# Altium schematic sheet [07] - QSFP28_1.SchDoc: QSFP28 Module
size A3; Engineer: *ORCEL THYS; DocumentNumber: 3; SheetNumber: 3; SheetTotal: 14
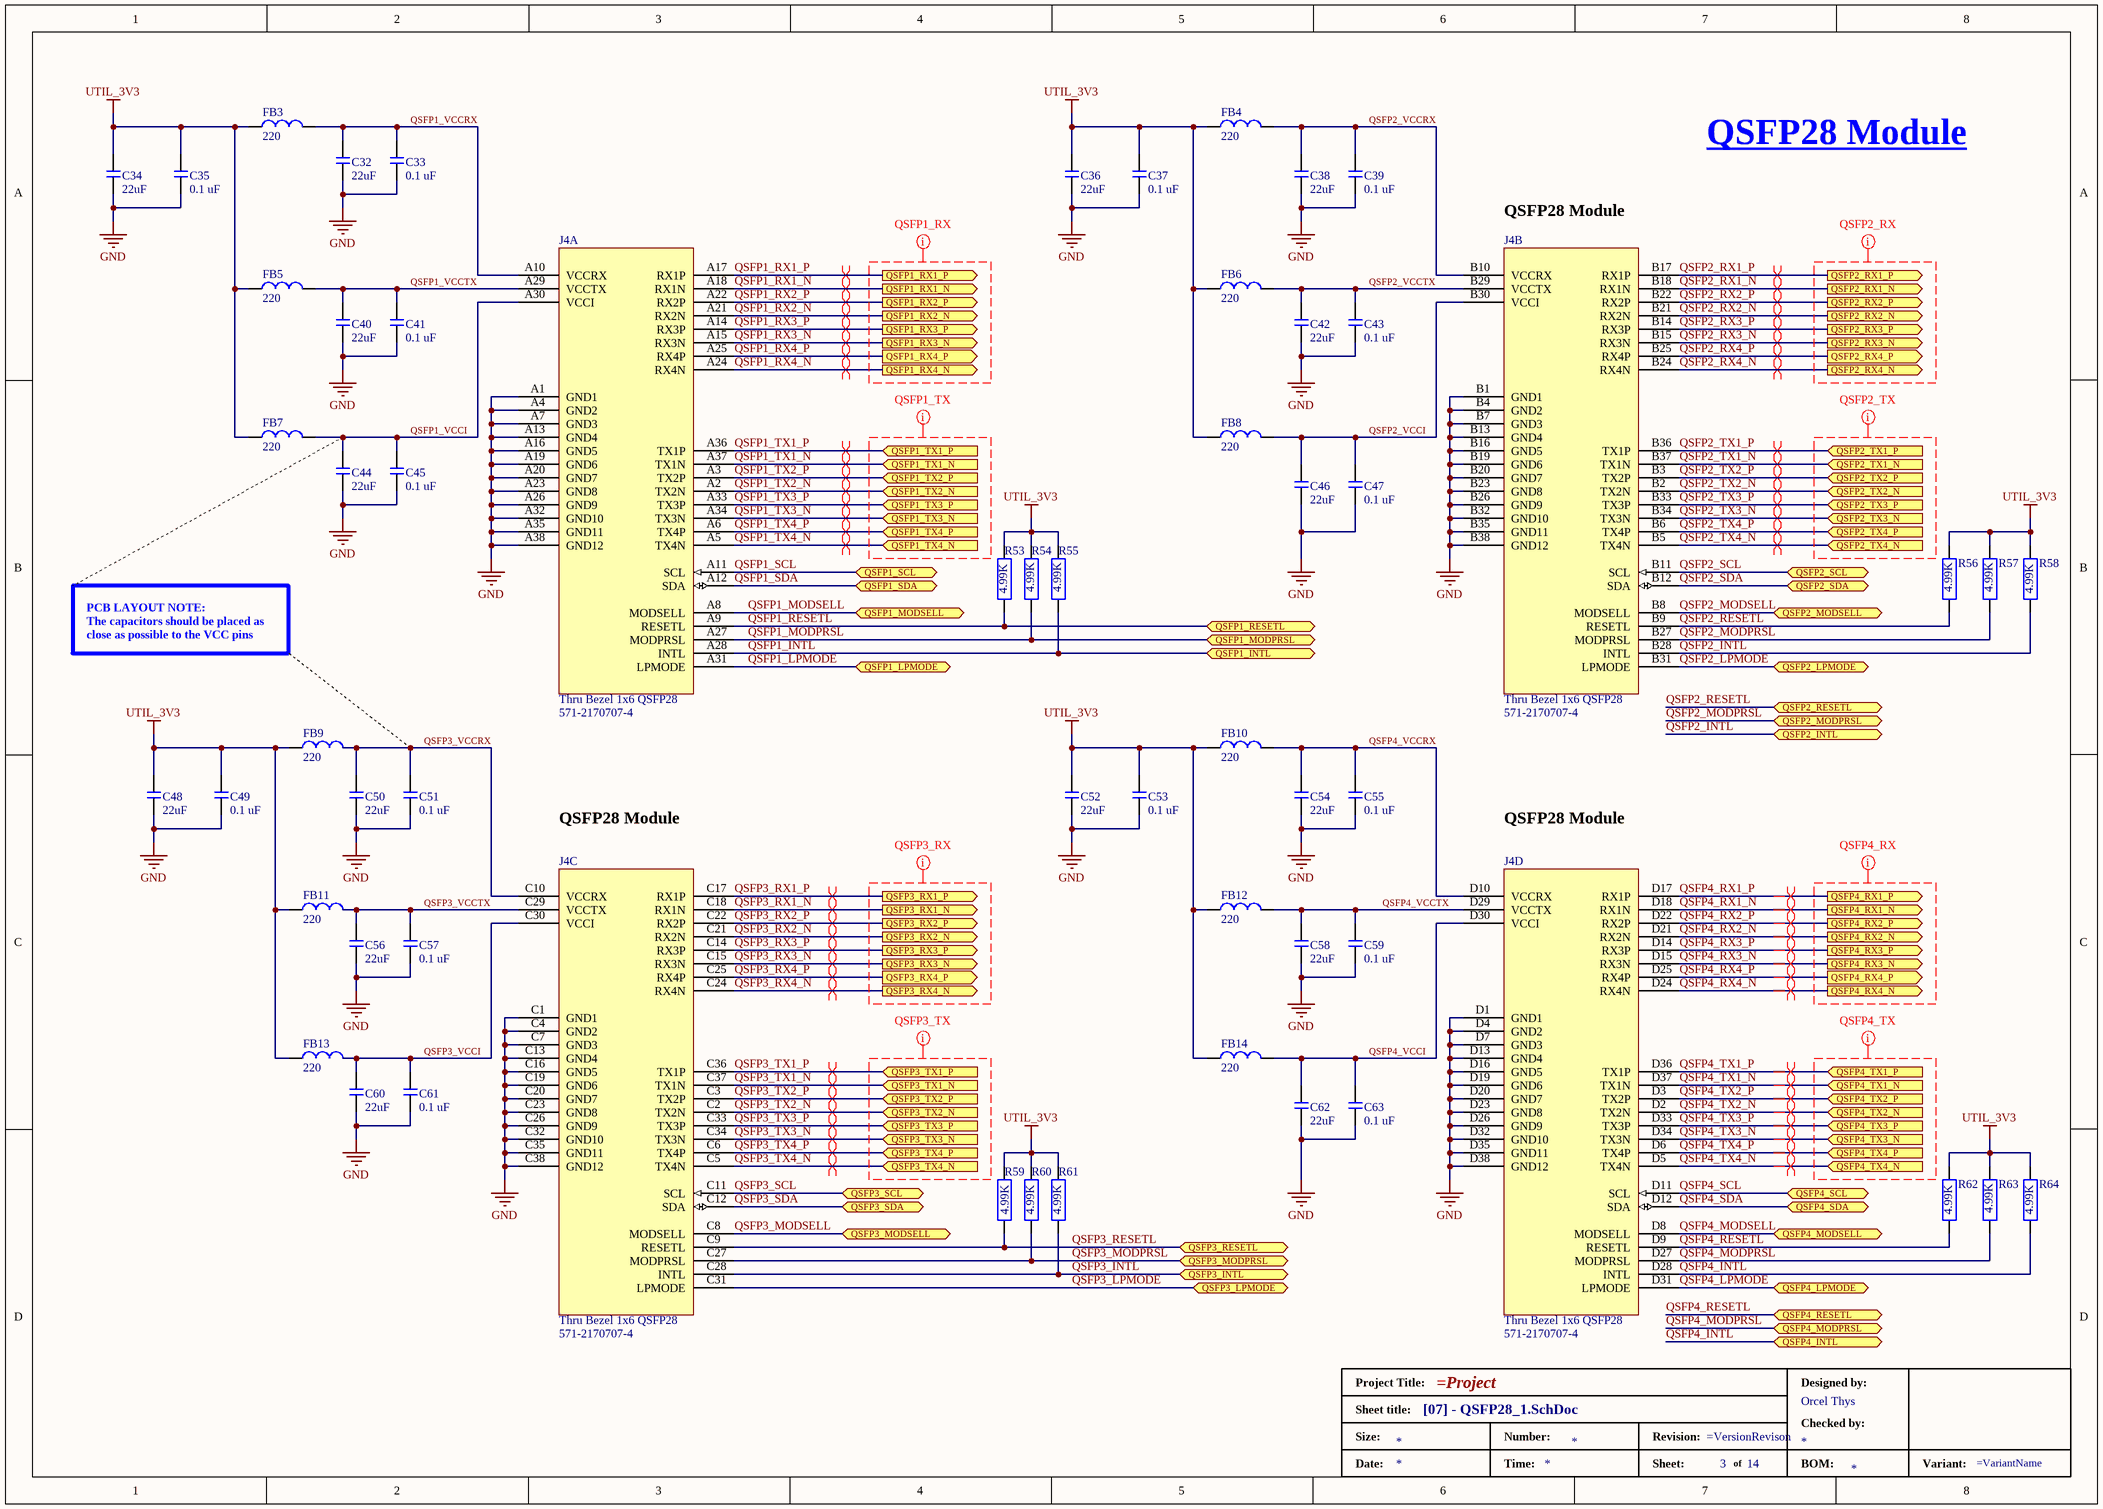
[diagram p0: [07] - QSFP28_1.SchDoc]

## Parts
*  DesignedBy: Orcel Thys  (hidden comment: Standard Title Block)  (graphical)
C32  22uF  [C2012]
C33  0.1 uF  [C0402]
C34  22uF  [C2012]
C35  0.1 uF  [C0402]
C36  22uF  [C2012]
C37  0.1 uF  [C0402]
C38  22uF  [C2012]
C39  0.1 uF  [C0402]
C40  22uF  [C2012]
C41  0.1 uF  [C0402]
C42  22uF  [C2012]
C43  0.1 uF  [C0402]
C44  22uF  [C2012]
C45  0.1 uF  [C0402]
C46  22uF  [C2012]
C47  0.1 uF  [C0402]
C48  22uF  [C2012]
C49  0.1 uF  [C0402]
C50  22uF  [C2012]
C51  0.1 uF  [C0402]
C52  22uF  [C2012]
C53  0.1 uF  [C0402]
C54  22uF  [C2012]
C55  0.1 uF  [C0402]
C56  22uF  [C2012]
C57  0.1 uF  [C0402]
C58  22uF  [C2012]
C59  0.1 uF  [C0402]
C60  22uF  [C2012]
C61  0.1 uF  [C0402]
C62  22uF  [C2012]
C63  0.1 uF  [C0402]
FB3  220  [BEADC1608X75N]
FB4  220  [BEADC1608X75N]
FB5  220  [BEADC1608X75N]
FB6  220  [BEADC1608X75N]
FB7  220  [BEADC1608X75N]
FB8  220  [BEADC1608X75N]
FB9  220  [BEADC1608X75N]
FB10  220  [BEADC1608X75N]
FB11  220  [BEADC1608X75N]
FB12  220  [BEADC1608X75N]
FB13  220  [BEADC1608X75N]
FB14  220  [BEADC1608X75N]
J4  Thru Bezel 1x6 QSFP28  Supplier Part Number 1: 571-2170707-4  [TE_2170707-4]  (parts A,B,C,D of 7)
R53  4.99K  [R0402]
R54  4.99K  [R0402]
R55  4.99K  [R0402]
R56  4.99K  [R0402]
R57  4.99K  [R0402]
R58  4.99K  [R0402]
R59  4.99K  [R0402]
R60  4.99K  [R0402]
R61  4.99K  [R0402]
R62  4.99K  [R0402]
R63  4.99K  [R0402]
R64  4.99K  [R0402]

## Ports
QSFP1_INTL (bidir), QSFP1_LPMODE (bidir), QSFP1_MODPRSL (bidir), QSFP1_MODSELL (bidir), QSFP1_RESETL (bidir), QSFP1_RX1_N (out), QSFP1_RX1_P (out), QSFP1_RX2_N (out), QSFP1_RX2_P (out), QSFP1_RX3_N (out), QSFP1_RX3_P (out), QSFP1_RX4_N (out), QSFP1_RX4_P (out), QSFP1_SCL (bidir), QSFP1_SDA (bidir), QSFP1_TX1_N (in), QSFP1_TX1_P (in), QSFP1_TX2_N (in), QSFP1_TX2_P (in), QSFP1_TX3_N (in), QSFP1_TX3_P (in), QSFP1_TX4_N (in), QSFP1_TX4_P (in), QSFP2_INTL (bidir), QSFP2_LPMODE (bidir), QSFP2_MODPRSL (bidir), QSFP2_MODSELL (bidir), QSFP2_RESETL (bidir), QSFP2_RX1_N (out), QSFP2_RX1_P (out), QSFP2_RX2_N (out), QSFP2_RX2_P (out), QSFP2_RX3_N (out), QSFP2_RX3_P (out), QSFP2_RX4_N (out), QSFP2_RX4_P (out), QSFP2_SCL (bidir), QSFP2_SDA (bidir), QSFP2_TX1_N (in), QSFP2_TX1_P (in), QSFP2_TX2_N (in), QSFP2_TX2_P (in), QSFP2_TX3_N (in), QSFP2_TX3_P (in), QSFP2_TX4_N (in), QSFP2_TX4_P (in), QSFP3_INTL (bidir), QSFP3_LPMODE (bidir), QSFP3_MODPRSL (bidir), QSFP3_MODSELL (bidir), QSFP3_RESETL (bidir), QSFP3_RX1_N (out), QSFP3_RX1_P (out), QSFP3_RX2_N (out), QSFP3_RX2_P (out), QSFP3_RX3_N (out), QSFP3_RX3_P (out), QSFP3_RX4_N (out), QSFP3_RX4_P (out), QSFP3_SCL (bidir), QSFP3_SDA (bidir), QSFP3_TX1_N (in), QSFP3_TX1_P (in), QSFP3_TX2_N (in), QSFP3_TX2_P (in), QSFP3_TX3_N (in), QSFP3_TX3_P (in), QSFP3_TX4_N (in), QSFP3_TX4_P (in), QSFP4_INTL (bidir), QSFP4_LPMODE (bidir), QSFP4_MODPRSL (bidir), QSFP4_MODSELL (bidir), QSFP4_RESETL (bidir), QSFP4_RX1_N (out), QSFP4_RX1_P (out), QSFP4_RX2_N (out), QSFP4_RX2_P (out), QSFP4_RX3_N (out), QSFP4_RX3_P (out), QSFP4_RX4_N (out), QSFP4_RX4_P (out), QSFP4_SCL (bidir), QSFP4_SDA (bidir), QSFP4_TX1_N (in), QSFP4_TX1_P (in), QSFP4_TX2_N (in), QSFP4_TX2_P (in), QSFP4_TX3_N (in), QSFP4_TX3_P (in), QSFP4_TX4_N (in), QSFP4_TX4_P (in)

## Nets
GND: C32.1 C33.1 C34.1 C35.1 C36.1 C37.1 C38.1 C39.1 C40.1 C41.1 C42.1 C43.1 C44.1 C45.1 C46.1 C47.1 C48.1 C49.1 C50.1 C51.1 C52.1 C53.1 C54.1 C55.1 C56.1 C57.1 C58.1 C59.1 C60.1 C61.1 C62.1 C63.1 J4.A1(GND1) J4.A4(GND2) J4.A7(GND3) J4.A13(GND4) J4.A16(GND5) J4.A19(GND6) J4.A20(GND7) J4.A23(GND8) J4.A26(GND9) J4.A32(GND10) J4.A35(GND11) J4.A38(GND12) J4.B1(GND1) J4.B4(GND2) J4.B7(GND3) J4.B13(GND4) J4.B16(GND5) J4.B19(GND6) J4.B20(GND7) J4.B23(GND8) J4.B26(GND9) J4.B32(GND10) J4.B35(GND11) J4.B38(GND12) J4.C1(GND1) J4.C4(GND2) J4.C7(GND3) J4.C13(GND4) J4.C16(GND5) J4.C19(GND6) J4.C20(GND7) J4.C23(GND8) J4.C26(GND9) J4.C32(GND10) J4.C35(GND11) J4.C38(GND12) J4.D1(GND1) J4.D4(GND2) J4.D7(GND3) J4.D13(GND4) J4.D16(GND5) J4.D19(GND6) J4.D20(GND7) J4.D23(GND8) J4.D26(GND9) J4.D32(GND10) J4.D35(GND11) J4.D38(GND12)
UTIL_3V3: C34.2 C35.2 C36.2 C37.2 C48.2 C49.2 C52.2 C53.2 FB3.1 FB4.1 FB5.1 FB6.1 FB7.1 FB8.1 FB9.1 FB10.1 FB11.1 FB12.1 FB13.1 FB14.1 R53.2 R54.2 R55.2 R56.2 R57.2 R58.2 R59.2 R60.2 R61.2 R62.2 R63.2 R64.2
QSFP1_INTL: J4.A28(INTL) R55.1 ; port QSFP1_INTL
QSFP1_LPMODE: J4.A31(LPMODE) ; port QSFP1_LPMODE
QSFP1_MODPRSL: J4.A27(MODPRSL) R54.1 ; port QSFP1_MODPRSL
QSFP1_MODSELL: J4.A8(MODSELL) ; port QSFP1_MODSELL
QSFP1_RESETL: J4.A9(RESETL) R53.1 ; port QSFP1_RESETL
QSFP1_RX1_N: J4.A18(RX1N) ; port QSFP1_RX1_N
QSFP1_RX1_P: J4.A17(RX1P) ; port QSFP1_RX1_P
QSFP1_RX2_N: J4.A21(RX2N) ; port QSFP1_RX2_N
QSFP1_RX2_P: J4.A22(RX2P) ; port QSFP1_RX2_P
QSFP1_RX3_N: J4.A15(RX3N) ; port QSFP1_RX3_N
QSFP1_RX3_P: J4.A14(RX3P) ; port QSFP1_RX3_P
QSFP1_RX4_N: J4.A24(RX4N) ; port QSFP1_RX4_N
QSFP1_RX4_P: J4.A25(RX4P) ; port QSFP1_RX4_P
QSFP1_SCL: J4.A11(SCL) ; port QSFP1_SCL
QSFP1_SDA: J4.A12(SDA) ; port QSFP1_SDA
QSFP1_TX1_N: J4.A37(TX1N) ; port QSFP1_TX1_N
QSFP1_TX1_P: J4.A36(TX1P) ; port QSFP1_TX1_P
QSFP1_TX2_N: J4.A2(TX2N) ; port QSFP1_TX2_N
QSFP1_TX2_P: J4.A3(TX2P) ; port QSFP1_TX2_P
QSFP1_TX3_N: J4.A34(TX3N) ; port QSFP1_TX3_N
QSFP1_TX3_P: J4.A33(TX3P) ; port QSFP1_TX3_P
QSFP1_TX4_N: J4.A5(TX4N) ; port QSFP1_TX4_N
QSFP1_TX4_P: J4.A6(TX4P) ; port QSFP1_TX4_P
QSFP1_VCCI: C44.2 C45.2 FB7.2 J4.A30(VCCI)
QSFP1_VCCRX: C32.2 C33.2 FB3.2 J4.A10(VCCRX)
QSFP1_VCCTX: C40.2 C41.2 FB5.2 J4.A29(VCCTX)
QSFP2_INTL: J4.B28(INTL) R58.1 ; port QSFP2_INTL
QSFP2_LPMODE: J4.B31(LPMODE) ; port QSFP2_LPMODE
QSFP2_MODPRSL: J4.B27(MODPRSL) R57.1 ; port QSFP2_MODPRSL
QSFP2_MODSELL: J4.B8(MODSELL) ; port QSFP2_MODSELL
QSFP2_RESETL: J4.B9(RESETL) R56.1 ; port QSFP2_RESETL
QSFP2_RX1_N: J4.B18(RX1N) ; port QSFP2_RX1_N
QSFP2_RX1_P: J4.B17(RX1P) ; port QSFP2_RX1_P
QSFP2_RX2_N: J4.B21(RX2N) ; port QSFP2_RX2_N
QSFP2_RX2_P: J4.B22(RX2P) ; port QSFP2_RX2_P
QSFP2_RX3_N: J4.B15(RX3N) ; port QSFP2_RX3_N
QSFP2_RX3_P: J4.B14(RX3P) ; port QSFP2_RX3_P
QSFP2_RX4_N: J4.B24(RX4N) ; port QSFP2_RX4_N
QSFP2_RX4_P: J4.B25(RX4P) ; port QSFP2_RX4_P
QSFP2_SCL: J4.B11(SCL) ; port QSFP2_SCL
QSFP2_SDA: J4.B12(SDA) ; port QSFP2_SDA
QSFP2_TX1_N: J4.B37(TX1N) ; port QSFP2_TX1_N
QSFP2_TX1_P: J4.B36(TX1P) ; port QSFP2_TX1_P
QSFP2_TX2_N: J4.B2(TX2N) ; port QSFP2_TX2_N
QSFP2_TX2_P: J4.B3(TX2P) ; port QSFP2_TX2_P
QSFP2_TX3_N: J4.B34(TX3N) ; port QSFP2_TX3_N
QSFP2_TX3_P: J4.B33(TX3P) ; port QSFP2_TX3_P
QSFP2_TX4_N: J4.B5(TX4N) ; port QSFP2_TX4_N
QSFP2_TX4_P: J4.B6(TX4P) ; port QSFP2_TX4_P
QSFP2_VCCI: C46.2 C47.2 FB8.2 J4.B30(VCCI)
QSFP2_VCCRX: C38.2 C39.2 FB4.2 J4.B10(VCCRX)
QSFP2_VCCTX: C42.2 C43.2 FB6.2 J4.B29(VCCTX)
QSFP3_INTL: J4.C28(INTL) R61.1 ; port QSFP3_INTL
QSFP3_LPMODE: J4.C31(LPMODE) ; port QSFP3_LPMODE
QSFP3_MODPRSL: J4.C27(MODPRSL) R60.1 ; port QSFP3_MODPRSL
QSFP3_MODSELL: J4.C8(MODSELL) ; port QSFP3_MODSELL
QSFP3_RESETL: J4.C9(RESETL) R59.1 ; port QSFP3_RESETL
QSFP3_RX1_N: J4.C18(RX1N) ; port QSFP3_RX1_N
QSFP3_RX1_P: J4.C17(RX1P) ; port QSFP3_RX1_P
QSFP3_RX2_N: J4.C21(RX2N) ; port QSFP3_RX2_N
QSFP3_RX2_P: J4.C22(RX2P) ; port QSFP3_RX2_P
QSFP3_RX3_N: J4.C15(RX3N) ; port QSFP3_RX3_N
QSFP3_RX3_P: J4.C14(RX3P) ; port QSFP3_RX3_P
QSFP3_RX4_N: J4.C24(RX4N) ; port QSFP3_RX4_N
QSFP3_RX4_P: J4.C25(RX4P) ; port QSFP3_RX4_P
QSFP3_SCL: J4.C11(SCL) ; port QSFP3_SCL
QSFP3_SDA: J4.C12(SDA) ; port QSFP3_SDA
QSFP3_TX1_N: J4.C37(TX1N) ; port QSFP3_TX1_N
QSFP3_TX1_P: J4.C36(TX1P) ; port QSFP3_TX1_P
QSFP3_TX2_N: J4.C2(TX2N) ; port QSFP3_TX2_N
QSFP3_TX2_P: J4.C3(TX2P) ; port QSFP3_TX2_P
QSFP3_TX3_N: J4.C34(TX3N) ; port QSFP3_TX3_N
QSFP3_TX3_P: J4.C33(TX3P) ; port QSFP3_TX3_P
QSFP3_TX4_N: J4.C5(TX4N) ; port QSFP3_TX4_N
QSFP3_TX4_P: J4.C6(TX4P) ; port QSFP3_TX4_P
QSFP3_VCCI: C60.2 C61.2 FB13.2 J4.C30(VCCI)
QSFP3_VCCRX: C50.2 C51.2 FB9.2 J4.C10(VCCRX)
QSFP3_VCCTX: C56.2 C57.2 FB11.2 J4.C29(VCCTX)
QSFP4_INTL: J4.D28(INTL) R64.1 ; port QSFP4_INTL
QSFP4_LPMODE: J4.D31(LPMODE) ; port QSFP4_LPMODE
QSFP4_MODPRSL: J4.D27(MODPRSL) R63.1 ; port QSFP4_MODPRSL
QSFP4_MODSELL: J4.D8(MODSELL) ; port QSFP4_MODSELL
QSFP4_RESETL: J4.D9(RESETL) R62.1 ; port QSFP4_RESETL
QSFP4_RX1_N: J4.D18(RX1N) ; port QSFP4_RX1_N
QSFP4_RX1_P: J4.D17(RX1P) ; port QSFP4_RX1_P
QSFP4_RX2_N: J4.D21(RX2N) ; port QSFP4_RX2_N
QSFP4_RX2_P: J4.D22(RX2P) ; port QSFP4_RX2_P
QSFP4_RX3_N: J4.D15(RX3N) ; port QSFP4_RX3_N
QSFP4_RX3_P: J4.D14(RX3P) ; port QSFP4_RX3_P
QSFP4_RX4_N: J4.D24(RX4N) ; port QSFP4_RX4_N
QSFP4_RX4_P: J4.D25(RX4P) ; port QSFP4_RX4_P
QSFP4_SCL: J4.D11(SCL) ; port QSFP4_SCL
QSFP4_SDA: J4.D12(SDA) ; port QSFP4_SDA
QSFP4_TX1_N: J4.D37(TX1N) ; port QSFP4_TX1_N
QSFP4_TX1_P: J4.D36(TX1P) ; port QSFP4_TX1_P
QSFP4_TX2_N: J4.D2(TX2N) ; port QSFP4_TX2_N
QSFP4_TX2_P: J4.D3(TX2P) ; port QSFP4_TX2_P
QSFP4_TX3_N: J4.D34(TX3N) ; port QSFP4_TX3_N
QSFP4_TX3_P: J4.D33(TX3P) ; port QSFP4_TX3_P
QSFP4_TX4_N: J4.D5(TX4N) ; port QSFP4_TX4_N
QSFP4_TX4_P: J4.D6(TX4P) ; port QSFP4_TX4_P
QSFP4_VCCI: C62.2 C63.2 FB14.2 J4.D30(VCCI)
QSFP4_VCCRX: C54.2 C55.2 FB10.2 J4.D10(VCCRX)
QSFP4_VCCTX: C58.2 C59.2 FB12.2 J4.D29(VCCTX)

## Layout directives
mark named QSFP1_RX: (no net found under the mark)
mark named QSFP1_TX: (no net found under the mark)
mark named QSFP2_RX: (no net found under the mark)
mark named QSFP2_TX: (no net found under the mark)
mark named QSFP3_RX: (no net found under the mark)
mark named QSFP3_TX: (no net found under the mark)
mark named QSFP4_RX: (no net found under the mark)
mark named QSFP4_TX: (no net found under the mark)
differential pair: QSFP1_RX1_N, QSFP1_RX1_P, QSFP1_RX2_N, QSFP1_RX2_P, QSFP1_RX3_N, QSFP1_RX3_P, QSFP1_RX4_N, QSFP1_RX4_P, QSFP1_TX1_N, QSFP1_TX1_P, QSFP1_TX2_N, QSFP1_TX2_P, QSFP1_TX3_N, QSFP1_TX3_P, QSFP1_TX4_N, QSFP1_TX4_P, QSFP2_RX1_N, QSFP2_RX1_P, QSFP2_RX2_N, QSFP2_RX2_P, QSFP2_RX3_N, QSFP2_RX3_P, QSFP2_RX4_N, QSFP2_RX4_P, QSFP2_TX1_N, QSFP2_TX1_P, QSFP2_TX2_N, QSFP2_TX2_P, QSFP2_TX3_N, QSFP2_TX3_P, QSFP2_TX4_N, QSFP2_TX4_P, QSFP3_RX1_N, QSFP3_RX1_P, QSFP3_RX2_N, QSFP3_RX2_P, QSFP3_RX3_N, QSFP3_RX3_P, QSFP3_RX4_N, QSFP3_RX4_P, QSFP3_TX1_N, QSFP3_TX1_P, QSFP3_TX2_N, QSFP3_TX2_P, QSFP3_TX3_N, QSFP3_TX3_P, QSFP3_TX4_N, QSFP3_TX4_P, QSFP4_RX1_N, QSFP4_RX1_P, QSFP4_RX2_N, QSFP4_RX2_P, QSFP4_RX3_N, QSFP4_RX3_P, QSFP4_RX4_N, QSFP4_RX4_P, QSFP4_TX1_N, QSFP4_TX1_P, QSFP4_TX2_N, QSFP4_TX2_P, QSFP4_TX3_N, QSFP4_TX3_P, QSFP4_TX4_N, QSFP4_TX4_P

## Notes on the sheet
- QSFP28 Module
- PCB LAYOUT NOTE:
  The capacitors should be placed as close as possible to the VCC pins
- Title
- Size:
- Date:
- A4
- Number:
- Time:
- Revision:
- Sheet
- of
- File:
- (in symbol Title_Block) Project Title:; Designed by:; Sheet title:; Checked by:; Size:; Number:; Revision:; Date:; Time:; Sheet:; of; BOM:; Variant:

## Library data of the parts
* = Title_Block: Size: *; BOM: *; DW: *; CheckedBy: *
C32 C34 C36 C38 C40 C42 C44 C46 C48 C50 C52 C54 C56 C58 C60 C62 = C2012X5R1V226M125AC: Cap Series 0805 22 uF 35 V ±20 % Tolerance X5R SMT Multilayer Ceramic Capacitor; Manufacturer: TDK; Tolerance: 20%; Voltage Rating: 35V; Supplier 1: Rs; Manufacturer Part Number: C2012X5R1V226M125AC; RoHS: Yes; Category: Ceramic Capacitors; Stock 1: 15560; Pricing 1: 50=0.544, 100=0.502, 250=0.458, 500=0.418 (EUR); Mount: Surface Mount; Case/Package: 0805; Case Code (Metric): 2012; Case Code (Imperial): 0805; Weight: 0.000194oz; Dielectric Material: Ceramic; Min Operating Temperature: -55°C; Max Operating Temperature: 85°C; Package Quantity: 1; Packaging: Tape and Reel; Capacitance: 22uF; Dielectric: X5R; Termination: SMD/SMT; Voltage Rating (DC): 35V; Series: C; Length: 0.079inch; Width: 0.049inch; Height: 1.25mm; Thickness: 0.057inch; Reach SVHC Compliant: No; Lead Free: Lead Free; RoHS Compliant: Yes; ComponentLink1URL: https://datasheet.ciiva.com/14893/tdkmlcccaprange-14893109.pdf?src-supplier=Digi-Key; ComponentLink1Description: https://datasheet.ciiva.com/14893/tdkmlcccaprange-14893109.pdf?src-supplier=Digi-Key; ComponentLink2URL: https://datasheet.ciiva.com/14893/tdkmlcccaprange-14893110.pdf?src-supplier=Digi-Key; ComponentLink2Description: https://datasheet.ciiva.com/14893/tdkmlcccaprange-14893110.pdf?src-supplier=Digi-Key; ComponentLink3URL: https://datasheet.ciiva.com/14893/tdkmlcccaprange-14893111.pdf?src-supplier=Digi-Key; ComponentLink3Description: https://datasheet.ciiva.com/14893/tdkmlcccaprange-14893111.pdf?src-supplier=Digi-Key; Supplier Part Number 1: 9159334P
C33 C35 C37 C39 C41 C43 C45 C47 C49 C51 C53 C55 C57 C59 C61 C63 = UMK105B7104KV-FR: Cap 0402 0.1 uF 50 V ±10 % Tolerance X7R Surface Mount Multilayer Ceramic Capacitor; Manufacturer: Taiyo Yuden; Voltage Rating: 50V; Capacitance: 100nF; Tolerance: 10%; Supplier 1: Rs; Manufacturer Part Number: UMK105B7104KV-FR; RoHS: Yes; Category: Ceramic Capacitors; Stock 1: 60000; Pricing 1: 10000=0.016 (EUR); Mount: Surface Mount; Case/Package: 0402; Case Code (Imperial): 0402; Case Code (Metric): 1005; Min Operating Temperature: -55°C; Max Operating Temperature: 125°C; Voltage Rating (DC): 50V; Packaging: Tape and Reel; Package Quantity: 1; Dielectric: X7R; Termination: SMD/SMT; Series: M; Length: 0.039inch; Width: 0.02inch; Height: 0.5mm; Thickness: 0.022inch; Lead Free: Lead Free; Halogen Free: Halogen Free; RoHS Compliant: Yes; ComponentLink1URL: https://datasheet.ciiva.com/24356/619umk105b7104kv-fr-24356845.pdf?src-supplier=Onlinecomponents.com; ComponentLink1Description: https://datasheet.ciiva.com/24356/619umk105b7104kv-fr-24356845.pdf?src-supplier=Onlinecomponents.com; ComponentLink2URL: https://datasheet.ciiva.com/30180/52umk105b7104kv-fr-30180098.pdf?src-supplier=Onlinecomponents.com; ComponentLink2Description: https://datasheet.ciiva.com/30180/52umk105b7104kv-fr-30180098.pdf?src-supplier=Onlinecomponents.com; ComponentLink3URL: https://datasheet.ciiva.com/18697/mlcc-all-e-18697452.pdf?src-supplier=Digi-Key; ComponentLink3Description: https://datasheet.ciiva.com/18697/mlcc-all-e-18697452.pdf?src-supplier=Digi-Key; ComponentLink4URL: https://datasheet.ciiva.com/18697/mlcc-all-e-18697451.pdf?src-supplier=Digi-Key; ComponentLink4Description: https://datasheet.ciiva.com/18697/mlcc-all-e-18697451.pdf?src-supplier=Digi-Key; ComponentLink5URL: https://datasheet.ciiva.com/18697/mlcc-all-e-18697453.pdf?src-supplier=Digi-Key; ComponentLink5Description: https://datasheet.ciiva.com/18697/mlcc-all-e-18697453.pdf?src-supplier=Digi-Key; Supplier Part Number 1: 1782869
FB3-FB14 = MPZ1608S221ATA00: 0603 220Ω ±25% DCR=0.050Ω 2.2A; Manufacturer: TDK; Core Material: Ferrite; Impedance: 220R; DC Resistance (DCR): 50mR; Number of Lines: 1; Supplier 1: Farnell; Manufacturer Part Number: MPZ1608S221ATA00; RoHS: Yes; Category: Ferrite Beads and Chips; Stock 1: 256000; Pricing 1: 4000=0.0235, 20000=0.023, 40000=0.0226 (EUR); Mount: Surface Mount; Case/Package: 0603; Number of Pins: 2; Case Code (Imperial): 0603; Case Code (Metric): 1608; Tolerance: 25%; Packaging: Cut Tape; Package Quantity: 1; Max DC Current: 2.2A; Series: MPZ; Current Rating: 2.2A; Max Current Rating: 2.2A; Length: 0.063inch; Width: 0.031inch; Height: 0.037inch; RoHS Compliant: Yes; Lead Free: Lead Free; Reach SVHC Compliant: No; ComponentLink1URL: https://datasheet.ciiva.com/8077/55167-8077073.pdf?src-supplier=Element14; ComponentLink1Description: https://datasheet.ciiva.com/8077/55167-8077073.pdf?src-supplier=Element14; ComponentLink2URL: https://datasheet.ciiva.com/8077/55167-8077071.pdf?src-supplier=Element14; ComponentLink2Description: https://datasheet.ciiva.com/8077/55167-8077071.pdf?src-supplier=Element14; ComponentLink3URL: https://datasheet.ciiva.com/46381/1486324-46381628.pdf?src-supplier=Element14; ComponentLink3Description: https://datasheet.ciiva.com/46381/1486324-46381628.pdf?src-supplier=Element14; ComponentLink4URL: https://datasheet.ciiva.com/46366/print-detail-pdf-phplangenpart-nompz1608s221ata00nreimp-unit-xmhz-46366044.pdf?src-supplier=Onlinecomponents.com; ComponentLink4Description: https://datasheet.ciiva.com/46366/print-detail-pdf-phplangenpart-nompz1608s221ata00nreimp-unit-xmhz-46366044.pdf?src-supplier=Onlinecomponents.com; Supplier Part Number 1: 2800773
J4 = 2170707-4: Cage Assy, 1X6, QSFP28, Spring, Hs; Manufacturer: TE Connectivity AMP; Supplier 1: Mouser; Manufacturer Part Number: 2170707-4; RoHS: Yes; Category: Connectors; Stock 1: 60; Pricing 1: 1=80.77, 10=80.77, 50=71.27, 100=70.28, 1000=67.22, 10000=67.22 (USD); ComponentLink1URL: https://www.te.com/commerce/DocumentDelivery/DDEController?Action=srchrtrv&DocNm=2170707&DocType=Customer+Drawing&DocLang=English&src-supplier=Digi-Key; ComponentLink1Description: https://www.te.com/commerce/DocumentDelivery/DDEController?Action=srchrtrv&DocNm=2170707&DocType=Customer+Drawing&DocLang=English&src-supplier=Digi-Key
R53-R64 = ERJ-2RKF4991X: RES SMD 4.99K OHM 1% 1/10W 0402; Manufacturer: Panasonic; Resistance: 4.99kR; Power Rating: 100mW; Voltage Rating: 50V; Temperature Coefficient: 100ppm/°C; Supplier 1: Mouser; Manufacturer Part Number: ERJ-2RKF4991X; RoHS: Yes; Category: Chip SMD Resistors; Stock 1: 1218727; Pricing 1: 1=0.1, 10=0.018, 50=0.018, 100=0.008, 1000=0.006, 10000=0.004 (USD); Mount: Surface Mount; Case/Package: 0402; Case Code (Metric): 1005; Case Code (Imperial): 0402; Contact Plating: Tin; Weight: 2.8E-05oz; Min Operating Temperature: -55°C; Max Operating Temperature: 155°C; Tolerance: 1%; Packaging: Tape and Reel; Package Quantity: 1; Resistor Type: Thick Film; Number of Terminations: 2; Termination: SMD/SMT; Max Power Dissipation: 100mW; Voltage Rating (DC): 50V; Features: Automotive AEC-Q200; Series: ERJ; Resistance Tolerance: 1%; Construction: Rectangular; Working Voltage: 50V; Technology: THICK FILM; Length: 1mm; Width: 0.5mm; Height: 0.016inch; Depth: 0.5mm; Radiation Hardening: No; Reach SVHC Compliant: No; Military Standard: Not; Lead Free: Lead Free; RoHS Compliant: Yes; ComponentLink1URL: https://datasheet.ciiva.com/46388/426256-46388311.pdf?src-supplier=Element14; ComponentLink1Description: https://datasheet.ciiva.com/46388/426256-46388311.pdf?src-supplier=Element14; ComponentLink2URL: https://datasheet.ciiva.com/46376/426256-46376955.pdf?src-supplier=Element14; ComponentLink2Description: https://datasheet.ciiva.com/46376/426256-46376955.pdf?src-supplier=Element14; ComponentLink3URL: https://datasheet.ciiva.com/22749/1678782-22749654.pdf?src-supplier=Element14; ComponentLink3Description: https://datasheet.ciiva.com/22749/1678782-22749654.pdf?src-supplier=Element14; ComponentLink4URL: https://datasheet.ciiva.com/24158/aoa0000ce2-24158871.pdf?src-supplier=Mouser; ComponentLink4Description: https://datasheet.ciiva.com/24158/aoa0000ce2-24158871.pdf?src-supplier=Mouser; ComponentLink5URL: https://datasheet.ciiva.com/16775/70260748-16775018.pdf?src-supplier=Allied+Electronics; ComponentLink5Description: https://datasheet.ciiva.com/16775/70260748-16775018.pdf?src-supplier=Allied+Electronics; ComponentLink6URL: https://datasheet.ciiva.com/16773/70260748-16773110.pdf?src-supplier=Allied+Electronics; ComponentLink6Description: https://datasheet.ciiva.com/16773/70260748-16773110.pdf?src-supplier=Allied+Electronics; ComponentLink7URL: https://datasheet.ciiva.com/16199/aoa0000ce2-16199546.pdf?src-supplier=Future+Electronics; ComponentLink7Description: https://datasheet.ciiva.com/16199/aoa0000ce2-16199546.pdf?src-supplier=Future+Electronics; Supplier Part Number 1: 667-ERJ-2RKF4991X